# EAGLE design Familamp (EAGLE 7.2.0)
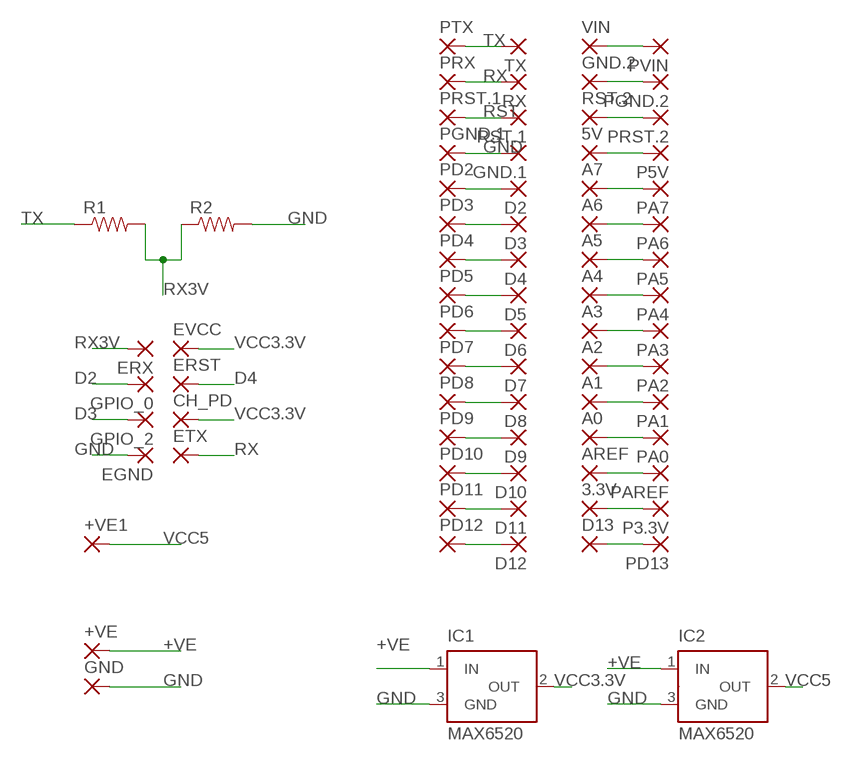
[diagram p0: schematic, sheet 1]

## Parts
3.3V  1,6/0,9  [1,6/0,9]
5V  1,6/0,9  [1,6/0,9]
+VE  2,15/1,0  [2,15/1,0]
+VE1  2,15/1,0  [2,15/1,0]
A0  1,6/0,9  [1,6/0,9]
A1  1,6/0,9  [1,6/0,9]
A2  1,6/0,9  [1,6/0,9]
A3  1,6/0,9  [1,6/0,9]
A4  1,6/0,9  [1,6/0,9]
A5  1,6/0,9  [1,6/0,9]
A6  1,6/0,9  [1,6/0,9]
A7  1,6/0,9  [1,6/0,9]
AREF  1,6/0,9  [1,6/0,9]
CH_PD  2,15/1,0  [2,15/1,0]
D2  1,6/0,9  [1,6/0,9]
D3  1,6/0,9  [1,6/0,9]
D4  1,6/0,9  [1,6/0,9]
D5  1,6/0,9  [1,6/0,9]
D6  1,6/0,9  [1,6/0,9]
D7  1,6/0,9  [1,6/0,9]
D8  1,6/0,9  [1,6/0,9]
D9  1,6/0,9  [1,6/0,9]
D10  1,6/0,9  [1,6/0,9]
D11  1,6/0,9  [1,6/0,9]
D12  1,6/0,9  [1,6/0,9]
D13  1,6/0,9  [1,6/0,9]
EGND  2,15/1,0  [2,15/1,0]
ERST  2,15/1,0  [2,15/1,0]
ERX  2,15/1,0  [2,15/1,0]
ETX  2,15/1,0  [2,15/1,0]
EVCC  2,15/1,0  [2,15/1,0]
GND  2,15/1,0  [2,15/1,0]
GND.1  1,6/0,9  [1,6/0,9]
GND.2  1,6/0,9  [1,6/0,9]
GPIO_0  2,15/1,0  [2,15/1,0]
GPIO_2  2,15/1,0  [2,15/1,0]
IC1  MAX6520  [SOT23]
IC2  MAX6520  [SOT23]
P3.3V  1,6/0,9  [1,6/0,9]
P5V  1,6/0,9  [1,6/0,9]
PA0  1,6/0,9  [1,6/0,9]
PA1  1,6/0,9  [1,6/0,9]
PA2  1,6/0,9  [1,6/0,9]
PA3  1,6/0,9  [1,6/0,9]
PA4  1,6/0,9  [1,6/0,9]
PA5  1,6/0,9  [1,6/0,9]
PA6  1,6/0,9  [1,6/0,9]
PA7  1,6/0,9  [1,6/0,9]
PAREF  1,6/0,9  [1,6/0,9]
PD2  1,6/0,9  [1,6/0,9]
PD3  1,6/0,9  [1,6/0,9]
PD4  1,6/0,9  [1,6/0,9]
PD5  1,6/0,9  [1,6/0,9]
PD6  1,6/0,9  [1,6/0,9]
PD7  1,6/0,9  [1,6/0,9]
PD8  1,6/0,9  [1,6/0,9]
PD9  1,6/0,9  [1,6/0,9]
PD10  1,6/0,9  [1,6/0,9]
PD11  1,6/0,9  [1,6/0,9]
PD12  1,6/0,9  [1,6/0,9]
PD13  1,6/0,9  [1,6/0,9]
PGND.1  1,6/0,9  [1,6/0,9]
PGND.2  1,6/0,9  [1,6/0,9]
PRST.1  1,6/0,9  [1,6/0,9]
PRST.2  1,6/0,9  [1,6/0,9]
PRX  1,6/0,9  [1,6/0,9]
PTX  1,6/0,9  [1,6/0,9]
PVIN  1,6/0,9  [1,6/0,9]
R1  RESISTORPTH-1/2W  [AXIAL-0.5]
R2  RESISTORPTH-1/2W  [AXIAL-0.5]
RST.1  1,6/0,9  [1,6/0,9]
RST.2  1,6/0,9  [1,6/0,9]
RX  1,6/0,9  [1,6/0,9]
TX  1,6/0,9  [1,6/0,9]
VIN  1,6/0,9  [1,6/0,9]

## Nets
3.3V: AREF.1(P) PAREF.1(P)
+VE: +VE.1(P) IC1.1(IN) IC2.1(IN) PVIN.1(P) VIN.1(P)
A0: A0.1(P) PA0.1(P)
A1: A1.1(P) PA1.1(P)
A2: A2.1(P) PA2.1(P)
A3: A3.1(P) PA3.1(P)
A4: A4.1(P) PA4.1(P)
A5: A5.1(P) PA5.1(P)
A6: A6.1(P) PA6.1(P)
A7: A7.1(P) PA7.1(P)
AREF: 3.3V.1(P) P3.3V.1(P)
D2: D2.1(P) GPIO_0.1(P) PD2.1(P)
D3: D3.1(P) GPIO_2.1(P) PD3.1(P)
D4: D4.1(P) ERST.1(P) PD4.1(P)
D5: D5.1(P) PD5.1(P)
D6: D6.1(P) PD6.1(P)
D7: D7.1(P) PD7.1(P)
D8: D8.1(P) PD8.1(P)
D9: D9.1(P) PD9.1(P)
D10: D10.1(P) PD10.1(P)
D11: D11.1(P) PD11.1(P)
D12: D12.1(P) PD12.1(P)
D13: D13.1(P) PD13.1(P)
GND: EGND.1(P) GND.1(P) GND.1.1(P) GND.2.1(P) IC1.3(GND) IC2.3(GND) PGND.1.1(P) PGND.2.1(P) R2.P$2
N$24: 5V.1(P) P5V.1(P)
RST: PRST.1.1(P) RST.1.1(P)
RST.2: PRST.2.1(P) RST.2.1(P)
RX: ETX.1(P) PRX.1(P) RX.1(P)
RX3V: ERX.1(P) R1.P$2 R2.P$1
TX: PTX.1(P) R1.P$1 TX.1(P)
VCC3.3V: CH_PD.1(P) EVCC.1(P) IC1.2(OUT)
VCC5: +VE1.1(P) IC2.2(OUT)

## Library data of the parts
3.3V 5V A0 A1-A7 AREF D2-D13 GND.1 GND.2 P3.3V P5V PA0 PA1-PA7 PAREF PD2-PD13 PGND.1 PGND.2 PRST.1 PRST.2 PRX PTX PVIN RST.1 RST.2 RX TX VIN = wirepad:1,6/0,9: THROUGH-HOLE PAD
+VE +VE1 CH_PD EGND ERST ERX ETX EVCC GND GPIO_0 GPIO_2 = wirepad:2,15/1,0: THROUGH-HOLE PAD
IC1 IC2 = maxim:MAX6520: 1.2V Voltage Reference 50ppm/°C, SOT23, 3-Terminal Source: Data sheet <http://datasheets.maxim-ic.com/en/ds/MAX6520.pdf>; MF: MAXIM; MPN: MAX6520EUR-T; OC_FARNELL: unknown; OC_NEWARK: 02J4586
R1 R2 = SparkFun-Passives:RESISTOR: Resistor Basic schematic elements and footprints for 0603, 1206, and PTH resistors.

## Board
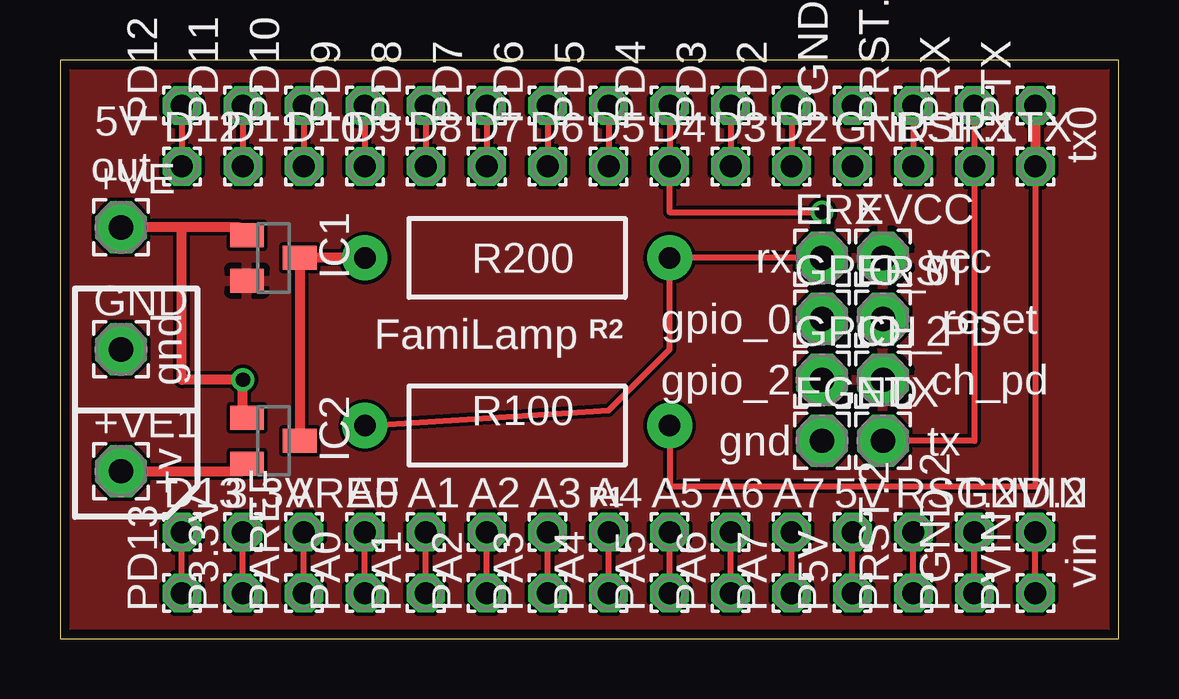
[diagram p1: board, top side]
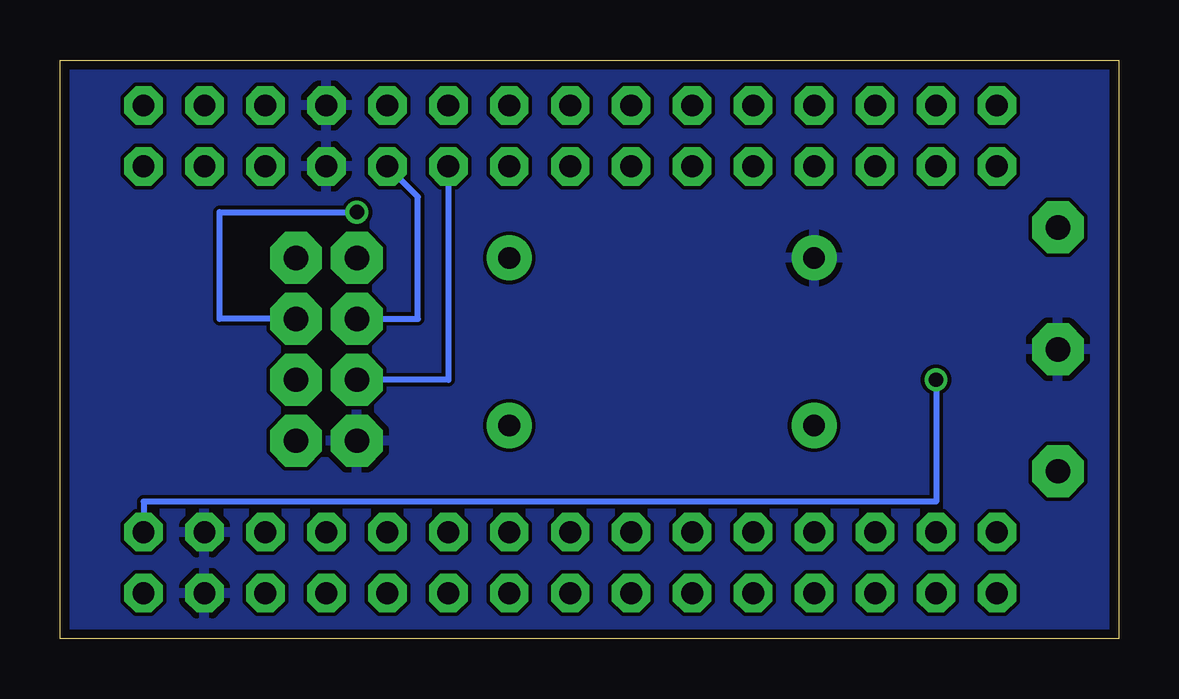
[diagram p2: board, bottom side, seen from below]

Size 44.12 x 24.12 mm. Coordinates in mm from the lower left corner, seen from the top.
Outline: 0,0 44.12,0 44.12,24.12 0,24.12 0,0
Copper layers (1*16): Top 0.0356mm / dielectric 1.5011mm / Bottom 0.0356mm
Design rules "default *": minimum track width 6mil, minimum drill 13mil, track to track 6mil, track to pad 6mil, pad to pad 6mil, via to via 6mil, smd to smd 6mil, copper to edge 15mil, drill to drill 6mil, minimum pad ring 7mil, minimum via ring 7mil, stop-mask expansion 3mil, vias tented up to drill 0mil, thermal gap 10mil

### Footprints (pad centres in the part's own frame; a part is rotated, then mirrored left to right if it is on the bottom)
1,6/0,9 = drill 0.914 pad 1.6 octagon: 1 0,0
2,15/1,0 = drill 1.016 pad 2.159 octagon: 1 0,0
SOT23 = smd 1 x 1.4: 1 -0.95,-1.1; 2 0.95,-1.1; 3 0,1.1
AXIAL-0.5 = drill 0.9 pad 1.88: P$1 -6.35,0; P$2 6.35,0

### Placement (x,y rotation side)
3.3V  7.62,4.45 0 top
5V  33.02,4.45 0 top
+VE  2.54,17.15 0 top
+VE1  2.54,6.98 0 top
A0  12.7,4.45 0 top
A1  15.24,4.45 0 top
A2  17.78,4.45 0 top
A3  20.32,4.45 0 top
A4  22.86,4.45 0 top
A5  25.4,4.45 0 top
A6  27.94,4.45 0 top
A7  30.48,4.45 0 top
AREF  10.16,4.45 0 top
CH_PD  34.29,10.79 0 top
D2  30.48,19.69 0 top
D3  27.94,19.69 0 top
D4  25.4,19.69 0 top
D5  22.86,19.69 0 top
D6  20.32,19.69 0 top
D7  17.78,19.69 0 top
D8  15.24,19.69 0 top
D9  12.7,19.69 0 top
D10  10.16,19.69 0 top
D11  7.62,19.69 0 top
D12  5.08,19.69 0 top
D13  5.08,4.45 0 top
EGND  31.75,8.26 0 top
ERST  34.29,13.33 0 top
ERX  31.75,15.88 0 top
ETX  34.29,8.26 0 top
EVCC  34.29,15.88 0 top
GND  2.54,12.06 0 top
GND.1  33.02,19.69 0 top
GND.2  38.1,4.45 0 top
GPIO_0  31.75,13.33 0 top
GPIO_2  31.75,10.79 0 top
IC1  8.89,15.88 270 top
IC2  8.89,8.26 270 top
P3.3V  7.62,1.91 90 top
P5V  33.02,1.91 90 top
PA0  12.7,1.91 90 top
PA1  15.24,1.91 90 top
PA2  17.78,1.91 90 top
PA3  20.32,1.91 90 top
PA4  22.86,1.91 90 top
PA5  25.4,1.91 90 top
PA6  27.94,1.91 90 top
PA7  30.48,1.91 90 top
PAREF  10.16,1.91 90 top
PD2  30.48,22.23 90 top
PD3  27.94,22.23 90 top
PD4  25.4,22.23 90 top
PD5  22.86,22.23 90 top
PD6  20.32,22.23 90 top
PD7  17.78,22.23 90 top
PD8  15.24,22.23 90 top
PD9  12.7,22.23 90 top
PD10  10.16,22.23 90 top
PD11  7.62,22.23 90 top
PD12  5.08,22.23 90 top
PD13  5.08,1.91 90 top
PGND.1  33.02,22.23 90 top
PGND.2  38.1,1.91 90 top
PRST.1  35.56,22.23 90 top
PRST.2  35.56,1.91 90 top
PRX  38.1,22.23 90 top
PTX  40.64,22.23 90 top
PVIN  40.64,1.91 90 top
R1  19.05,8.89 180 top
R2  19.05,15.88 180 top
RST.1  35.56,19.69 0 top
RST.2  35.56,4.45 0 top
RX  38.1,19.69 0 top
TX  40.64,19.69 0 top
VIN  40.64,4.45 0 top

### Tracks (layer width: path | path; a pad name or v marks a point on that pad's centre or on a via)
3.3V
  Top 0.254: PAREF.1 AREF.1
+VE  (via drill 0.6)
  Top 0.254: PVIN.1 VIN.1 | IC2.1 7.62,9.38 | IC1.1 7.47,17.15
  Top 0.406: 7.62,9.38 v7.62,10.79 5.08,10.79 5.08,17.15 | 7.47,17.15 5.08,17.15 | 5.08,17.15 +VE.1
  Bottom 0.254: v7.62,10.79 7.62,5.71 40.64,5.71 VIN.1
A0
  Top 0.254: PA0.1 A0.1
A1
  Top 0.254: PA1.1 A1.1
A2
  Top 0.254: PA2.1 A2.1
A3
  Top 0.254: PA3.1 A3.1
A4
  Top 0.254: PA4.1 A4.1
A5
  Top 0.254: PA5.1 A5.1
A6
  Top 0.254: PA6.1 A6.1
A7
  Top 0.254: PA7.1 A7.1
AREF
  Top 0.254: P3.3V.1 3.3V.1
D2
  Top 0.254: PD2.1 D2.1
  Bottom 0.254: GPIO_0.1 29.21,13.33 29.21,18.42 D2.1
D3
  Top 0.254: PD3.1 D3.1
  Bottom 0.254: D3.1 27.94,10.79 GPIO_2.1
D4  (via drill 0.6)
  Top 0.254: PD4.1 D4.1 25.4,17.78 v31.75,17.78
  Bottom 0.254: ERST.1 37.47,13.33 37.47,17.78 v31.75,17.78
D5
  Top 0.254: PD5.1 D5.1
D6
  Top 0.254: PD6.1 D6.1
D7
  Top 0.254: PD7.1 D7.1
D8
  Top 0.254: PD8.1 D8.1
D9
  Top 0.254: PD9.1 D9.1
D10
  Top 0.254: PD10.1 D10.1
D11
  Top 0.254: PD11.1 D11.1
D12
  Top 0.254: PD12.1 D12.1
D13
  Top 0.254: PD13.1 D13.1
GND
  Top 0.152: 10.06,8.26 IC2.3
  Top 0.254: PGND.2.1 GND.2.1
  Top 0.406: IC2.3 IC1.3 R2.P$2
  pour Bottom: -2.54,26.04 -2.54,-0.64 49.53,-0.64 48.26,26.04
N$2  (via drill 0.6)
  other vias: 31.75,17.78
N$24
  Top 0.254: P5V.1 5V.1
RST
  Top 0.254: PRST.1.1 RST.1.1
RST.2
  Top 0.254: PRST.2.1 RST.2.1
RX
  Top 0.254: PRX.1 RX.1 38.1,8.26 ETX.1
RX3V
  Top 0.254: ERX.1 R2.P$1 25.4,12.06 22.86,9.53 R1.P$2
TX
  Top 0.254: TX.1 40.64,6.35 25.4,6.35 R1.P$1
  Top 0.406: PTX.1 TX.1
VCC3.3V
  pour Top: -1.27,24.77 -1.27,-0.64 49.53,-0.64 49.53,24.77
VCC5
  Top 0.152: IC2.2 7.77,7.19 7.77,7.04 7.62,6.98
  Top 0.406: +VE1.1 7.62,6.98

### Text on the board
tPlace: 5V / out | tx0 | R200 | rx | vcc | gpio_0 | FamiLamp | reset | gnd | gpio_2 | ch_pd | R100 | gnd | tx | +v | vin